# Altium schematic sheet 2Motors_ctrl_2S.SchDoc: 2 x triple half-bridge power stage
size A4; Organization: Use Organization_Name in ProjParam; Address1: Eliot Ferragni; Address2: STI-IMT-LSRO; Address3: EPFL; Address4: CH-1015 LAUSANNE; DocumentNumber: 10; Revision: A; SheetNumber: 10; SheetTotal: 10; ApprovedBy: Init ApprovedBy in DocParam; CheckedBy: Init CheckedBy in DocParam; Author: Init Author in DocParam; CompanyName: Init CompanyName in DocParam; DrawnBy: Init DrawBy in DocParam; Engineer: Init Engineer in DocParam; DocumentName: Init DocumentName in DocParam; ProjectName: Init ProjectName in DocParam
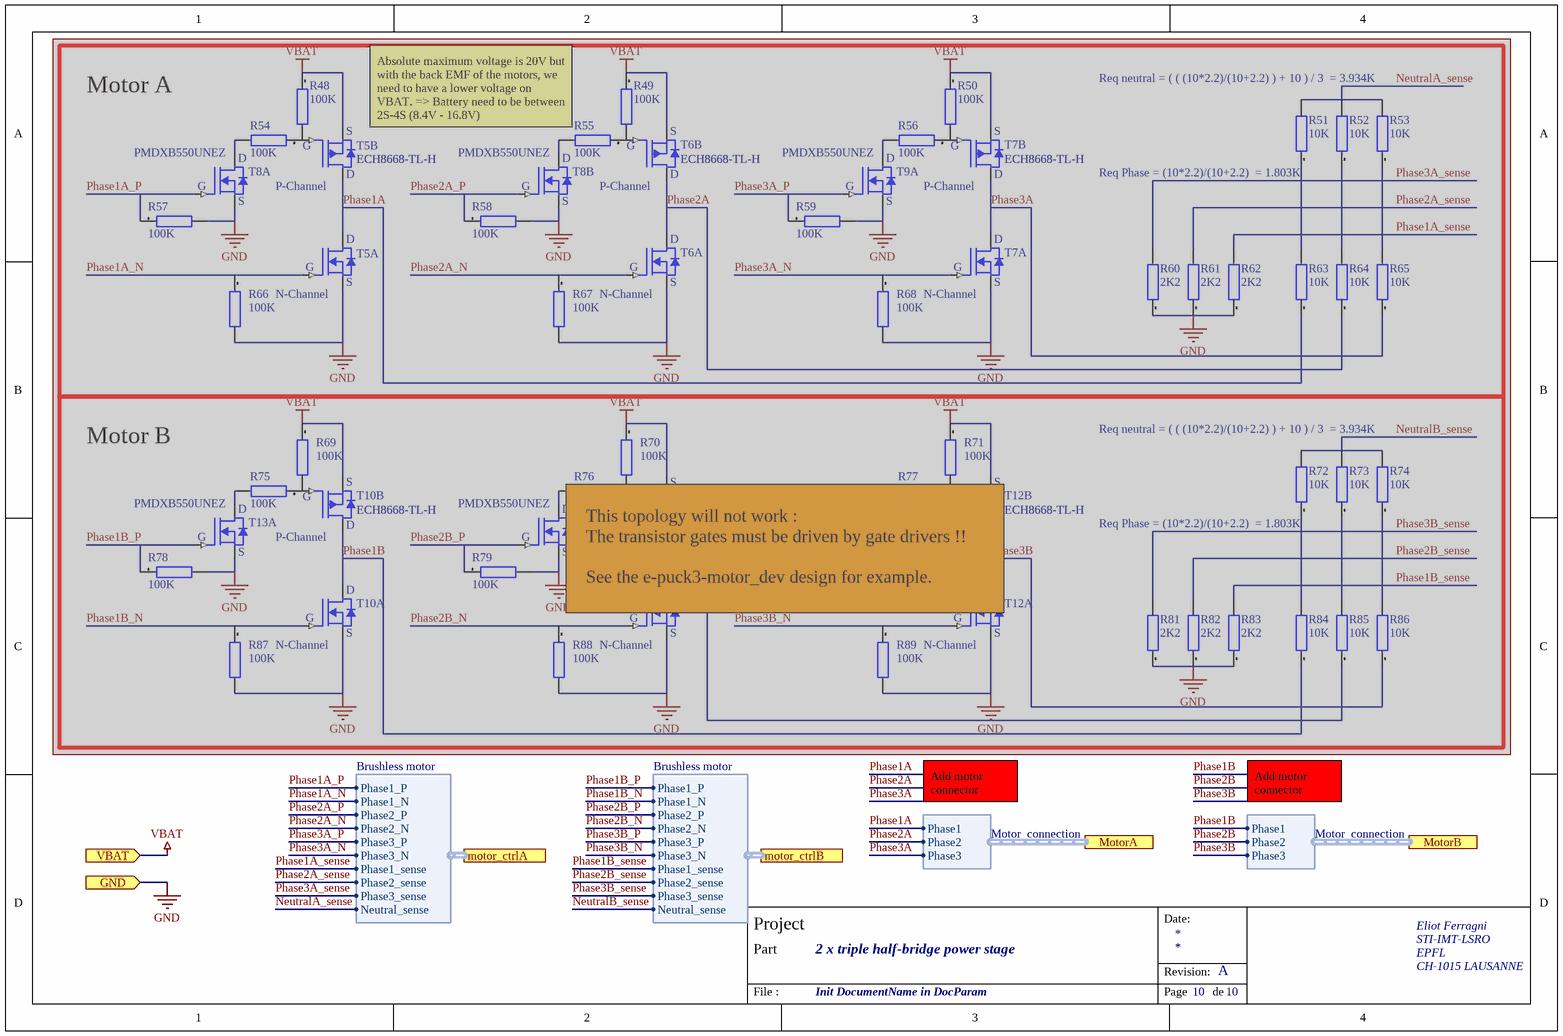
[diagram p0: 2Motors_ctrl_2S.SchDoc]

## Parts
R48  100K  [RESC0201(0603)_L]  (masked out: inside a compile mask, not in the netlist)
R49  100K  [RESC0201(0603)_L]  (masked out: inside a compile mask, not in the netlist)
R50  100K  [RESC0201(0603)_L]  (masked out: inside a compile mask, not in the netlist)
R51  10K  [RESC0201(0603)_L]  (masked out: inside a compile mask, not in the netlist)
R52  10K  [RESC0201(0603)_L]  (masked out: inside a compile mask, not in the netlist)
R53  10K  [RESC0201(0603)_L]  (masked out: inside a compile mask, not in the netlist)
R54  100K  [RESC0201(0603)_L]  (masked out: inside a compile mask, not in the netlist)
R55  100K  [RESC0201(0603)_L]  (masked out: inside a compile mask, not in the netlist)
R56  100K  [RESC0201(0603)_L]  (masked out: inside a compile mask, not in the netlist)
R57  100K  [RESC0201(0603)_L]  (masked out: inside a compile mask, not in the netlist)
R58  100K  [RESC0201(0603)_L]  (masked out: inside a compile mask, not in the netlist)
R59  100K  [RESC0201(0603)_L]  (masked out: inside a compile mask, not in the netlist)
R60  2K2  [RESC0201(0603)_L]  (masked out: inside a compile mask, not in the netlist)
R61  2K2  [RESC0201(0603)_L]  (masked out: inside a compile mask, not in the netlist)
R62  2K2  [RESC0201(0603)_L]  (masked out: inside a compile mask, not in the netlist)
R63  10K  [RESC0201(0603)_L]  (masked out: inside a compile mask, not in the netlist)
R64  10K  [RESC0201(0603)_L]  (masked out: inside a compile mask, not in the netlist)
R65  10K  [RESC0201(0603)_L]  (masked out: inside a compile mask, not in the netlist)
R66  100K  [RESC0201(0603)_L]  (masked out: inside a compile mask, not in the netlist)
R67  100K  [RESC0201(0603)_L]  (masked out: inside a compile mask, not in the netlist)
R68  100K  [RESC0201(0603)_L]  (masked out: inside a compile mask, not in the netlist)
R69  100K  [RESC0201(0603)_L]  (masked out: inside a compile mask, not in the netlist)
R70  100K  [RESC0201(0603)_L]  (masked out: inside a compile mask, not in the netlist)
R71  100K  [RESC0201(0603)_L]  (masked out: inside a compile mask, not in the netlist)
R72  10K  [RESC0201(0603)_L]  (masked out: inside a compile mask, not in the netlist)
R73  10K  [RESC0201(0603)_L]  (masked out: inside a compile mask, not in the netlist)
R74  10K  [RESC0201(0603)_L]  (masked out: inside a compile mask, not in the netlist)
R75  100K  [RESC0201(0603)_L]  (masked out: inside a compile mask, not in the netlist)
R76  100K  [RESC0201(0603)_L]  (masked out: inside a compile mask, not in the netlist)
R77  100K  [RESC0201(0603)_L]  (masked out: inside a compile mask, not in the netlist)
R78  100K  [RESC0201(0603)_L]  (masked out: inside a compile mask, not in the netlist)
R79  100K  [RESC0201(0603)_L]  (masked out: inside a compile mask, not in the netlist)
R80  100K  [RESC0201(0603)_L]  (masked out: inside a compile mask, not in the netlist)
R81  2K2  [RESC0201(0603)_L]  (masked out: inside a compile mask, not in the netlist)
R82  2K2  [RESC0201(0603)_L]  (masked out: inside a compile mask, not in the netlist)
R83  2K2  [RESC0201(0603)_L]  (masked out: inside a compile mask, not in the netlist)
R84  10K  [RESC0201(0603)_L]  (masked out: inside a compile mask, not in the netlist)
R85  10K  [RESC0201(0603)_L]  (masked out: inside a compile mask, not in the netlist)
R86  10K  [RESC0201(0603)_L]  (masked out: inside a compile mask, not in the netlist)
R87  100K  [RESC0201(0603)_L]  (masked out: inside a compile mask, not in the netlist)
R88  100K  [RESC0201(0603)_L]  (masked out: inside a compile mask, not in the netlist)
R89  100K  [RESC0201(0603)_L]  (masked out: inside a compile mask, not in the netlist)
T5  ECH8668-TL-H  [8-SMD Flat lead]  (parts A,B of 2)  (masked out: inside a compile mask, not in the netlist)
T6  ECH8668-TL-H  [8-SMD Flat lead]  (parts A,B of 2)  (masked out: inside a compile mask, not in the netlist)
T7  ECH8668-TL-H  [8-SMD Flat lead]  (parts A,B of 2)  (masked out: inside a compile mask, not in the netlist)
T8  PMDXB550UNEZ  [DFN1010B-6]  (parts A,B of 2)  (masked out: inside a compile mask, not in the netlist)
T9  PMDXB550UNEZ  [DFN1010B-6]  (parts A,B of 2)  (masked out: inside a compile mask, not in the netlist)
T10  ECH8668-TL-H  [8-SMD Flat lead]  (parts A,B of 2)  (masked out: inside a compile mask, not in the netlist)
T11  ECH8668-TL-H  [8-SMD Flat lead]  (parts A,B of 2)  (masked out: inside a compile mask, not in the netlist)
T12  ECH8668-TL-H  [8-SMD Flat lead]  (parts A,B of 2)  (masked out: inside a compile mask, not in the netlist)
T13  PMDXB550UNEZ  [DFN1010B-6]  (parts A,B of 2)  (masked out: inside a compile mask, not in the netlist)

## Blocks framed on the sheet
Motor A: R48-R68 T5-T9
Motor B: R69-R89 T9-T13

## Ports
GND (in), motor_ctrlA (harness Brushless motor), motor_ctrlB (harness Brushless motor), MotorA (harness Motor_connection), MotorB (harness Motor_connection), VBAT (in)

## Harnesses
Brushless motor: Phase1_P, Phase1_N, Phase2_P, Phase2_N, Phase3_P, Phase3_N, Phase1_sense, Phase2_sense, Phase3_sense, Neutral_sense
Motor_connection: Phase1, Phase2, Phase3

## Nets
GND: port GND
VBAT: port VBAT
NeutralA_sense: port motor_ctrlA.Neutral_sense
NeutralB_sense: port motor_ctrlB.Neutral_sense
Phase1A: port MotorA.Phase1
Phase1A_N: port motor_ctrlA.Phase1_N
Phase1A_P: port motor_ctrlA.Phase1_P
Phase1A_sense: port motor_ctrlA.Phase1_sense
Phase1B: port MotorB.Phase1
Phase1B_N: port motor_ctrlB.Phase1_N
Phase1B_P: port motor_ctrlB.Phase1_P
Phase1B_sense: port motor_ctrlB.Phase1_sense
Phase2A: port MotorA.Phase2
Phase2A_N: port motor_ctrlA.Phase2_N
Phase2A_P: port motor_ctrlA.Phase2_P
Phase2A_sense: port motor_ctrlA.Phase2_sense
Phase2B: port MotorB.Phase2
Phase2B_N: port motor_ctrlB.Phase2_N
Phase2B_P: port motor_ctrlB.Phase2_P
Phase2B_sense: port motor_ctrlB.Phase2_sense
Phase3A: port MotorA.Phase3
Phase3A_N: port motor_ctrlA.Phase3_N
Phase3A_P: port motor_ctrlA.Phase3_P
Phase3A_sense: port motor_ctrlA.Phase3_sense
Phase3B: port MotorB.Phase3
Phase3B_N: port motor_ctrlB.Phase3_N
Phase3B_P: port motor_ctrlB.Phase3_P
Phase3B_sense: port motor_ctrlB.Phase3_sense

## Notes on the sheet
- Req neutral = ( ( (10*2.2)/(10+2.2) ) + 10 ) / 3  = 3.934K
- (near R55) Absolute maximum voltage is 20V but with the back EMF of the motors, we need to have a lower voltage on VBAT. => Battery need to be between 2S-4S (8.4V - 16.8V)
- Req Phase = (10*2.2)/(10+2.2)  = 1.803K
- This topology will not work :
  The transistor gates must be driven by gate drivers !!
  See the e-puck3-motor_dev design for example.
- Add motor connector
- Date:
- Project
- Part
- Revision:
- File :
- Page
- de
- (in symbol ECH8668-TL-H, part A) N-Channel
- (in symbol ECH8668-TL-H, part B) P-Channel

## Library data of the parts
R48-R89 = TBD[[/\]]0201[[/\]]1: Resistor ToDo 0201; Preference: 1; Currentie: CHF; Size: 0201; Footprint Acort: 0201; ROHS: True; DateLastUpdate: 2018-10-19 / 9:06:49 AM
T5-T7 T10-T12 = ECH8668-TL-H: MOSFET N/P-CH 20V 7.5A/5A ECH8; Manufacturer: ON Semiconductor; FET Type: N and P-Channel; FET Feature: Logic Level Gate; Current - Continuous Drain (Id) @ 25°C: 7.5A, 5A; Rds On (Max) @ Id, Vgs: 17 mOhm @ 4A, 4.5V; Gate Charge (Qg) (Max) @ Vgs: 10.8nC @ 4.5V; Input Capacitance (Ciss) (Max) @ Vds: 1060pF @ 10V; Power - Max: 1.5W; Supplier 1: Digi-Key; Manufacturer Part Number: ECH8668-TL-H; RoHS: RoHS Compliant; Category: Discrete Semiconductor Products; Stock 1: 3111; Pricing 1: 1=0.93, 10=0.811, 100=0.6259, 500=0.46362, 1000=0.37089 (USD); Packaging: Cut Tape (CT); Part Status: Active; Drain to Source Voltage (Vdss): 20V; Vgs(th) (Max) @ Id: -; Operating Temperature: 150°C (TJ); Mounting Type: Surface Mount; Package / Case: 8-SMD, Flat Lead; Supplier Device Package: 8-ECH; ComponentLink1URL: http://www.onsemi.com/pub/Collateral/ECH8668-D.PDF; ComponentLink1Description: http://www.onsemi.com/pub/Collateral/ECH8668-D.PDF; Supplier Part Number 1: ECH8668-TL-HOSCT-ND
T8 T9 T13 = PMDXB550UNEZ: DUAL N-CHANNEL 30V; Manufacturer: NXP Semiconductors; Continuous Drain Current (ID): 590mA; Max Power Dissipation: 285mW; Rds On Max: 670mR; Input Capacitance: 30.3pF; FET Type: 2 N-Channel; Supplier 1: Digi-Key; Stock 1: 5582; Pricing 1: 1=0.48, 10=0.379, 100=0.2601, 500=0.17838, 1000=0.13379 (USD); Mount: Surface Mount; Min Operating Temperature: -55°C; Max Operating Temperature: 150°C; Drain to Source Voltage (Vdss): 30V; Packaging: Tape and Reel; Supplier Part Number 1: 1727-2277-1-ND; Manufacturer Part Number: PMDXB550UNEZ